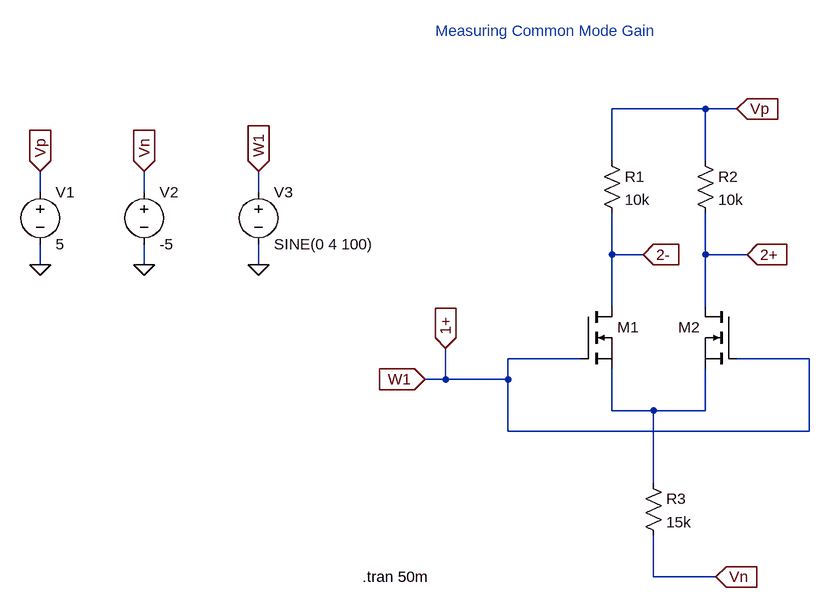
[diagram p0: schematic common_mode_gain_mos_ltspice.asc]
common_mode_gain_mos_ltspice.asc, the LTspice schematic file:
Version 4
SHEET 1 880 680
WIRE 352 -160 208 -160
WIRE 400 -160 352 -160
WIRE 208 -80 208 -160
WIRE 352 -80 352 -160
WIRE -672 -32 -672 -64
WIRE -512 -32 -512 -64
WIRE -336 -32 -336 -64
WIRE 208 64 208 0
WIRE 256 64 208 64
WIRE 352 64 352 0
WIRE 416 64 352 64
WIRE -672 80 -672 48
WIRE -512 80 -512 48
WIRE -336 80 -336 48
WIRE 208 144 208 64
WIRE 352 144 352 64
WIRE 160 224 48 224
WIRE 512 224 400 224
WIRE -48 256 -48 208
WIRE -48 256 -80 256
WIRE 48 256 48 224
WIRE 48 256 -48 256
WIRE 208 304 208 240
WIRE 272 304 208 304
WIRE 352 304 352 240
WIRE 352 304 272 304
WIRE 48 336 48 256
WIRE 512 336 512 224
WIRE 512 336 48 336
WIRE 272 416 272 304
WIRE 272 560 272 496
WIRE 368 560 272 560
FLAG -80 256 W1
IOPIN -80 256 In
FLAG 368 560 Vn
IOPIN 368 560 In
FLAG 400 -160 Vp
IOPIN 400 -160 In
FLAG -672 80 0
FLAG -512 80 0
FLAG -336 80 0
FLAG -672 -64 Vp
IOPIN -672 -64 In
FLAG -512 -64 Vn
IOPIN -512 -64 In
FLAG -336 -64 W1
IOPIN -336 -64 In
FLAG 416 64 2+
IOPIN 416 64 In
FLAG -48 208 1+
IOPIN -48 208 In
FLAG 256 64 2-
IOPIN 256 64 In
SYMBOL res 192 -96 R0
SYMATTR InstName R1
SYMATTR Value 10k
SYMBOL res 336 -96 R0
SYMATTR InstName R2
SYMATTR Value 10k
SYMBOL res 256 400 R0
SYMATTR InstName R3
SYMATTR Value 15k
SYMBOL voltage -672 -48 R0
WINDOW 123 0 0 Left 0
WINDOW 39 0 0 Left 0
SYMATTR InstName V1
SYMATTR Value 5
SYMBOL voltage -512 -48 R0
WINDOW 123 0 0 Left 0
WINDOW 39 0 0 Left 0
SYMATTR InstName V2
SYMATTR Value -5
SYMBOL voltage -336 -48 R0
WINDOW 123 0 0 Left 0
WINDOW 39 0 0 Left 0
SYMATTR InstName V3
SYMATTR Value SINE(0 4 100)
SYMBOL nmos 160 144 R0
WINDOW 3 56 72 Invisible 2
SYMATTR Value BSP89
SYMATTR InstName M1
SYMBOL nmos 400 144 M0
WINDOW 3 56 72 Invisible 2
SYMATTR Value BSP89
SYMATTR InstName M2
TEXT -176 560 Left 2 !.tran 50m
TEXT -64 -280 Left 2 ;Measuring Common Mode Gain

The netlist it stands for:
* common_mode_gain_mos_ltspice.asc
R1 Vp 2- 10k
R2 Vp 2+ 10k
R3 N001 Vn 15k
V1 Vp 0 5
V2 Vn 0 -5
V3 1+ 0 SINE(0 4 100)
M1 2- 1+ N001 N001 BSP89
M2 2+ 1+ N001 N001 BSP89
.model NMOS NMOS
.model PMOS PMOS
.lib standard.mos
.tran 50m
* Measuring Common Mode Gain
.backanno
.end